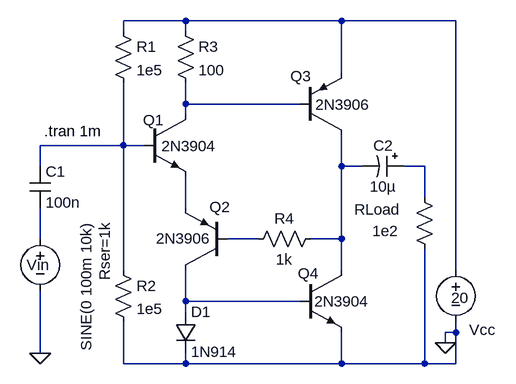
[diagram p0: schematic DiscrOpAmp.asc]
DiscrOpAmp.asc, the LTspice schematic file:
Version 4
SHEET 1 880 680
WIRE -144 240 -144 208
WIRE -144 352 -144 304
WIRE -144 528 -144 432
WIRE -16 32 -16 16
WIRE -16 208 -144 208
WIRE -16 208 -16 112
WIRE -16 400 -16 208
WIRE -16 544 -16 480
WIRE 16 208 -16 208
WIRE 80 16 -16 16
WIRE 80 32 80 16
WIRE 80 144 80 112
WIRE 80 160 80 144
WIRE 80 304 80 256
WIRE 80 448 80 400
WIRE 80 464 80 448
WIRE 80 544 -16 544
WIRE 80 544 80 528
WIRE 192 352 144 352
WIRE 256 144 80 144
WIRE 256 448 80 448
WIRE 320 16 80 16
WIRE 320 96 320 16
WIRE 320 240 320 192
WIRE 320 352 272 352
WIRE 320 352 320 240
WIRE 320 400 320 352
WIRE 320 544 80 544
WIRE 320 544 320 496
WIRE 352 240 320 240
WIRE 448 240 416 240
WIRE 448 288 448 240
WIRE 448 544 320 544
WIRE 448 544 448 368
WIRE 480 512 480 496
WIRE 496 16 320 16
WIRE 496 400 496 16
WIRE 496 496 480 496
WIRE 496 496 496 480
WIRE 496 544 448 544
WIRE 496 544 496 496
FLAG 480 512 0
FLAG -144 528 0
SYMBOL pnp2 144 400 R180
WINDOW 0 -5 97 Left 0
WINDOW 3 25 49 Left 0
SYMATTR InstName Q2
SYMATTR Value 2N3906
SYMBOL npn2 16 160 R0
WINDOW 0 -2 9 Left 0
WINDOW 3 27 49 Left 0
SYMATTR InstName Q1
SYMATTR Value 2N3904
SYMBOL res -32 16 R0
SYMATTR InstName R1
SYMATTR Value 1e5
SYMBOL res -32 384 R0
SYMATTR InstName R2
SYMATTR Value 1e5
SYMBOL res 64 16 R0
SYMATTR InstName R3
SYMATTR Value 100
SYMBOL res 288 336 R90
WINDOW 0 0 56 VBottom 0
WINDOW 3 32 56 VTop 0
SYMATTR InstName R4
SYMATTR Value 1k
SYMBOL pnp2 256 192 M180
WINDOW 0 -15 91 Left 0
WINDOW 3 24 47 Left 0
SYMATTR InstName Q3
SYMATTR Value 2N3906
SYMBOL npn2 256 400 R0
WINDOW 0 -3 5 Left 0
WINDOW 3 22 48 Left 0
SYMATTR InstName Q4
SYMATTR Value 2N3904
SYMBOL diode 64 464 R0
WINDOW 3 24 62 Left 0
SYMATTR Value 1N914
SYMATTR InstName D1
SYMBOL voltage 496 384 R0
WINDOW 0 21 108 Left 0
WINDOW 3 -7 59 Left 0
SYMATTR InstName Vcc
SYMATTR Value 20
SYMBOL res 464 384 R180
WINDOW 0 53 77 Left 0
WINDOW 3 56 44 Left 0
SYMATTR InstName RLoad
SYMATTR Value 1e2
SYMBOL voltage -144 336 R0
WINDOW 0 -21 56 Left 0
WINDOW 3 71 -10 VRight 0
WINDOW 123 0 0 Left 0
WINDOW 39 99 -10 VRight 0
SYMATTR InstName Vin
SYMATTR Value SINE(0 100m 10k)
SYMATTR SpiceLine Rser=1k
SYMBOL cap -160 240 R0
SYMATTR InstName C1
SYMATTR Value 100n
SYMBOL polcap 416 224 R90
WINDOW 0 0 32 VBottom 0
WINDOW 3 32 32 VTop 0
SYMATTR InstName C2
SYMATTR Value 10µ
SYMATTR Description Capacitor
SYMATTR Type cap
SYMATTR SpiceLine V=33 Irms=0 Rser=0.25 MTBF=0 Lser=0 mfg="KEMET" pn="T495X106M035AS" type="Tantalum" ppPkg=1
TEXT -138 186 Left 0 !.tran 1m

The netlist it stands for:
* DiscrOpAmp.asc
Q2 N006 N007 N005 0 2N3906
Q1 N004 N001 N005 0 2N3904
R1 N003 N001 1e5
R2 N001 0 1e5
R3 N003 N004 100
R4 N008 N007 1k
Q3 N008 N004 N003 0 2N3906
Q4 N008 N006 0 0 2N3904
D1 N006 0 1N914
Vcc N003 0 20
RLoad 0 N009 1e2
Vin N002 0 SINE(0 100m 10k) Rser=1k
C1 N001 N002 100n
C2 N009 N008 10µ V=33 Irms=0 Rser=0.25 MTBF=0 Lser=0 mfg="KEMET" pn="T495X106M035AS" type="Tantalum" ppPkg=1
.model D D
.lib standard.dio
.model NPN NPN
.model PNP PNP
.lib standard.bjt
.tran 1m
.backanno
.end